# Altium schematic sheet IMU.SchDoc: =project_title
size Tabloid; CompanyName: Luxonis Holding; Organization: Luxonis Holding; Address1: 1925 Harmony Park Drive; Address2: Westminster, CO; Address3: 80234; Address4: United States; SheetNumber: 4; SheetTotal: 11
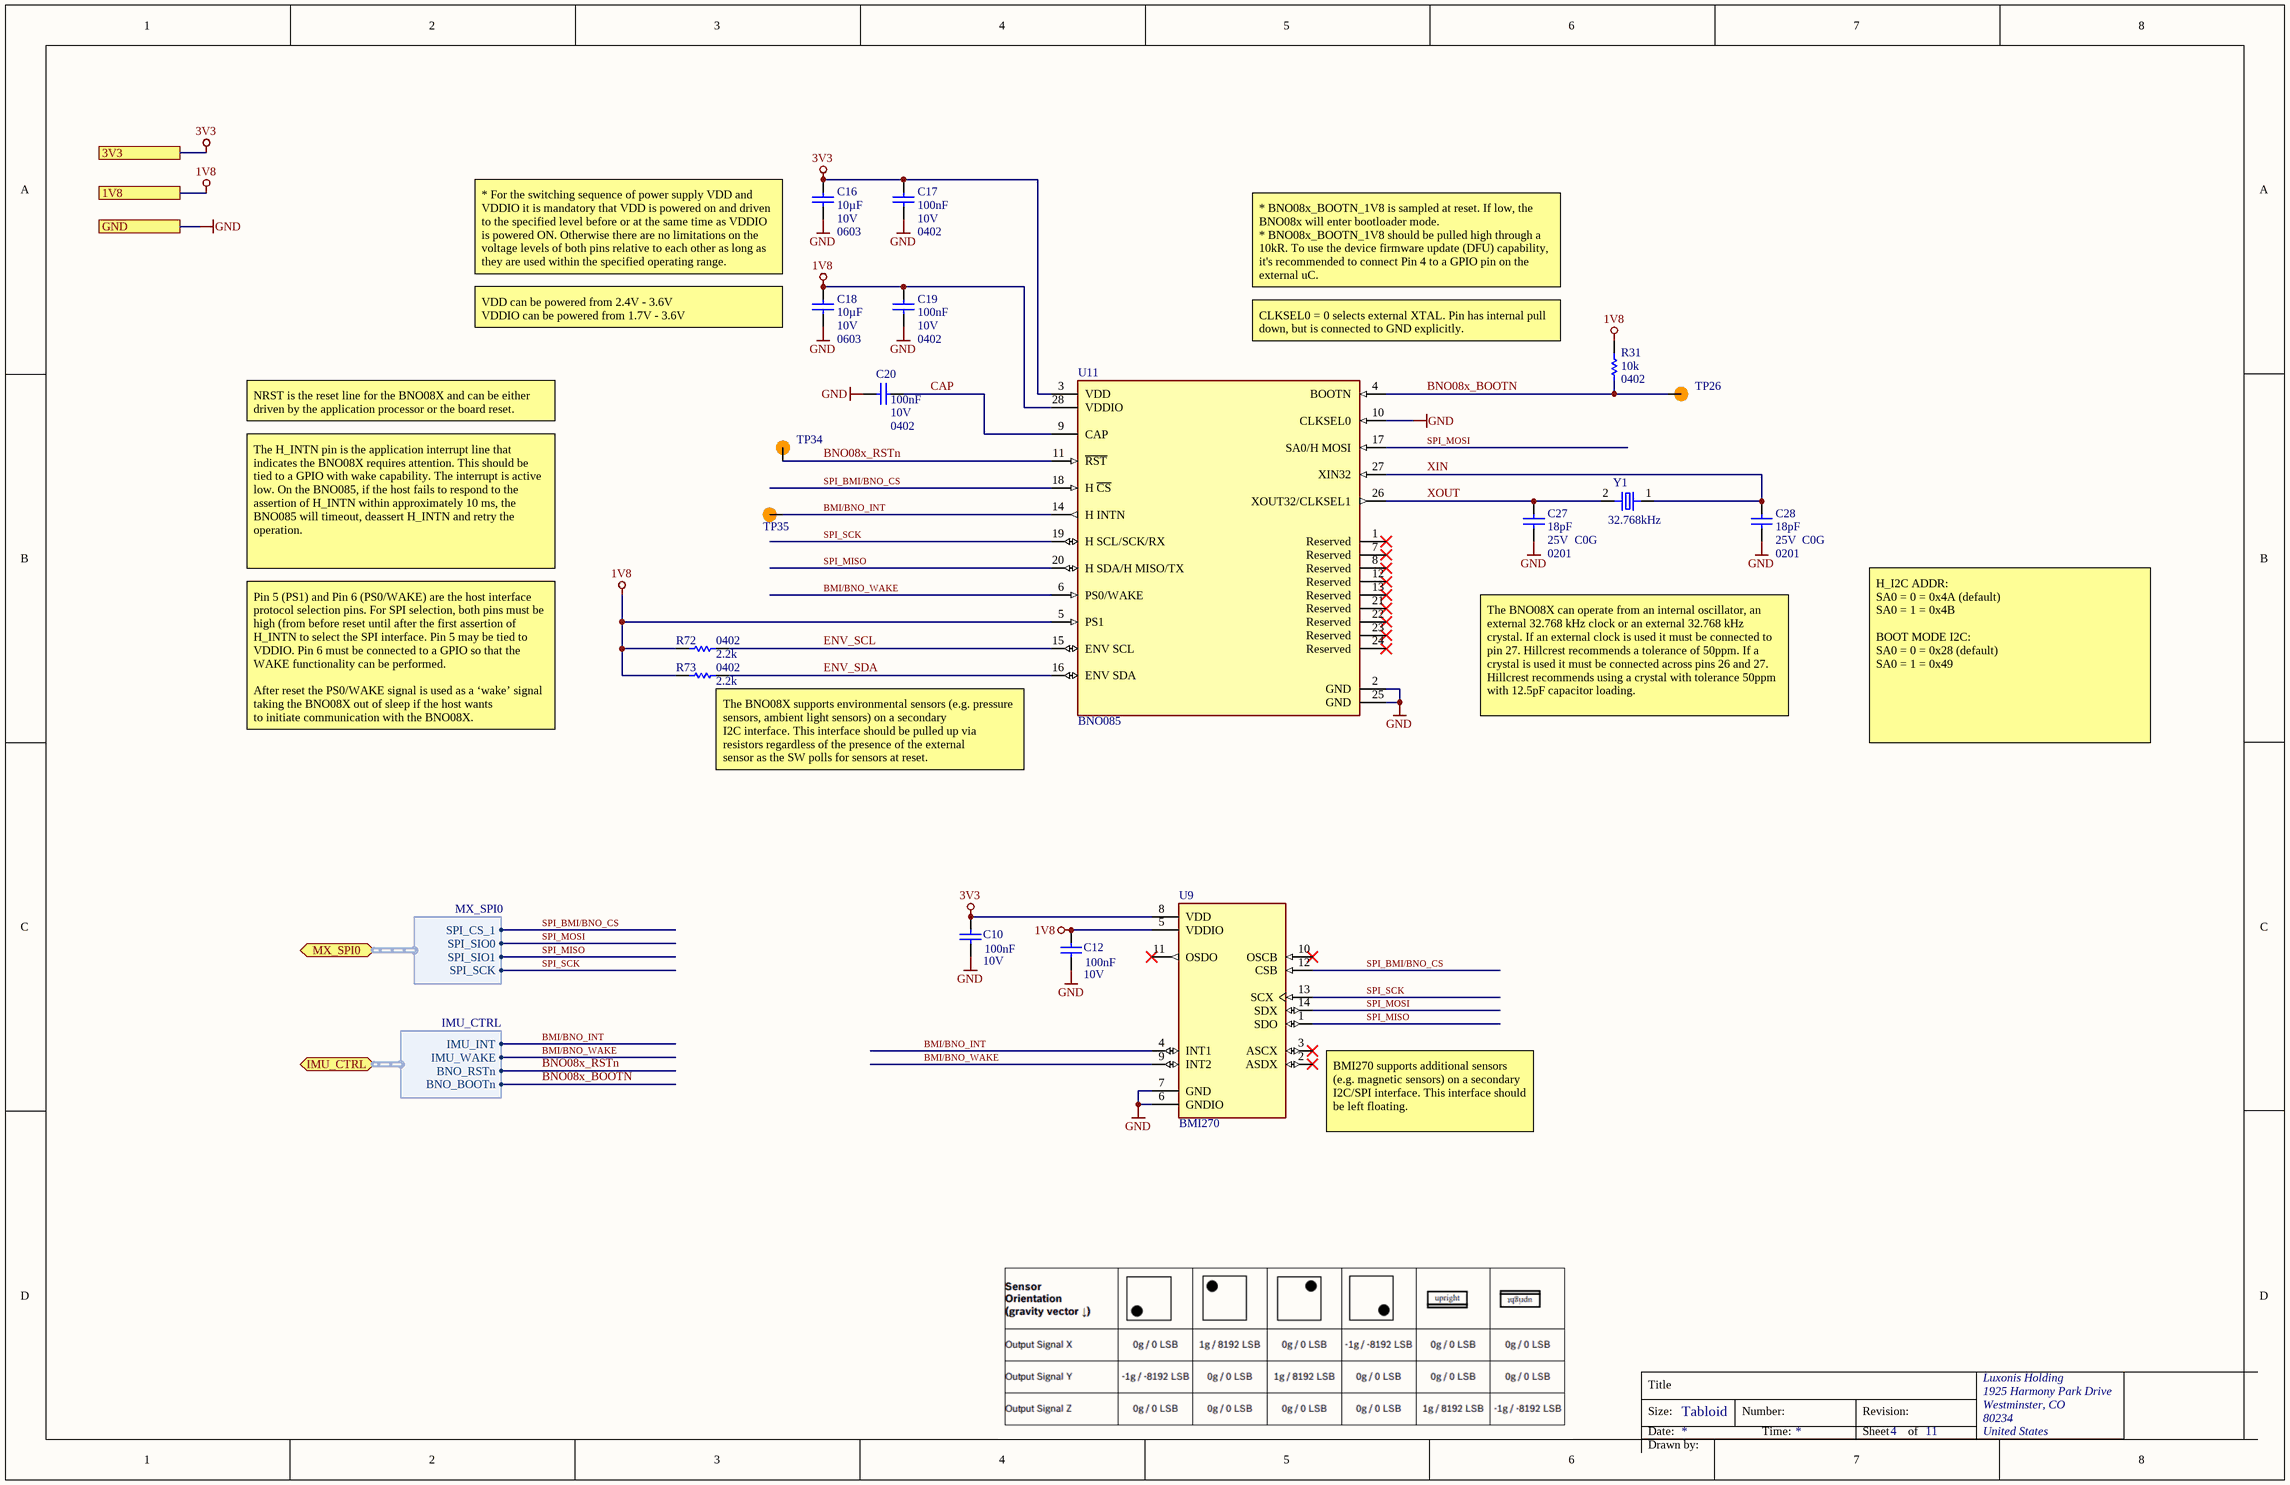
[diagram p0: IMU.SchDoc]

## Parts
C10  value 100nF  Voltage Rating: 10V  [CAPC0402(1005)70_L]  (hidden comment: GRM155R71A104JA01D)
C12  value 100nF  Voltage Rating: 10V  [CAPC0402(1005)70_L]  (hidden comment: GRM155R71A104JA01D)
C16  value 10µF  Case/Package: 0603  Voltage Rating: 10V  [CAPC0603(1608)100_L]  (hidden comment: GRM188R61A106ME69D)
C17  value 100nF  Case/Package: 0402  Voltage Rating: 10V  [CAPC0402(1005)70_N]  (hidden comment: GRM155R71A104JA01D)
C18  value 10µF  Case/Package: 0603  Voltage Rating: 10V  [CAPC0603(1608)100_L]  (hidden comment: GRM188R61A106ME69D)
C19  value 100nF  Case/Package: 0402  Voltage Rating: 10V  [CAPC0402(1005)70_N]  (hidden comment: GRM155R71A104JA01D)
C20  value 100nF  Case/Package: 0402  Voltage Rating: 10V  [CAPC0402(1005)70_N]  (hidden comment: GRM155R71A104JA01D)
C27  value 18pF  Case/Package: 0201  Voltage Rating: 25V  Dielectric: C0G  [CAPC0201(0603)33_L]  (hidden comment: GRM0335C1E180FA01D)
C28  value 18pF  Case/Package: 0201  Voltage Rating: 25V  Dielectric: C0G  [CAPC0201(0603)33_L]  (hidden comment: GRM0335C1E180FA01D)
R31  value 10k  Case/Package: 0402  [RESC0402(1005)_L]  (hidden comment: RC0402FR-1310KL)
R72  value 2.2k  Case/Package: 0402  [RESC0402(1005)_L]  (hidden comment: RC0402FR-072K2L)
R73  value 2.2k  Case/Package: 0402  [RESC0402(1005)_L]  (hidden comment: RC0402FR-072K2L)
TP26  TEST_POINT  [TP100_200_NS]  (value not drawn)  (no BOM)
TP34  TEST_POINT  [TP100_200_NS]  (value not drawn)  (no BOM)
TP35  TEST_POINT  [TP100_200_NS]  (value not drawn)  (no BOM)
U9  BMI270  [XDCR_BMI270]
U11  BNO085  [BNO085]
Y1  Frequency: 32.768kHz  [ABS06-127-32.768KHZ-T]  (hidden comment: ABS06-127-32.768KHZ-T)

## Ports
1V8, 3V3, GND, IMU_CTRL (bidir, harness IMU_CTRL), MX_SPI0 (bidir, harness MX_SPI0)

## Harnesses
MX_SPI0: SPI_SIO0, SPI_SIO1, SPI_CS_1, SPI_SCK
IMU_CTRL: IMU_INT, IMU_WAKE, BNO_RSTn, BNO_BOOTn

## Nets
1V8: C12.2 C18.2 C19.2 R31.2 R72.1 R73.1 U9.5(VDDIO) U11.5(PS1) U11.28(VDDIO) ; port 1V8
3V3: C10.2 C16.2 C17.2 U9.8(VDD) U11.3(VDD) ; port 3V3
GND: C10.1 C12.1 C16.1 C17.1 C18.1 C19.1 C20.2 C27.1 C28.1 U9.6(GNDIO) U9.7(GND) U11.2(GND) U11.10(CLKSEL0) U11.25(GND) ; port GND
BMI/BNO_INT: TP35.1 U9.4(INT1) U11.14(H_INTN) ; port IMU_CTRL.IMU_INT
BMI/BNO_WAKE: U9.9(INT2) U11.6(PS0/WAKE) ; port IMU_CTRL.IMU_WAKE
BNO08x_BOOTN: R31.1 TP26.1 U11.4(BOOTN) ; port IMU_CTRL.BNO_BOOTn
BNO08x_RSTn: TP34.1 U11.11(~{RST}) ; port IMU_CTRL.BNO_RSTn
CAP: C20.1 U11.9(CAP)
ENV_SCL: R72.2 U11.15(ENV_SCL)
ENV_SDA: R73.2 U11.16(ENV_SDA)
SPI_BMI/BNO_CS: U9.12(CSB) U11.18(H_~{CS}) ; port MX_SPI0.SPI_CS_1
SPI_MISO: U9.1(SDO) U11.20(H_SDA/H_MISO/TX) ; port MX_SPI0.SPI_SIO1
SPI_MOSI: U9.14(SDX) U11.17(SA0/H_MOSI) ; port MX_SPI0.SPI_SIO0
SPI_SCK: U9.13(SCX) U11.19(H_SCL/SCK/RX) ; port MX_SPI0.SPI_SCK
XIN: C28.2 U11.27(XIN32) Y1.1
XOUT: C27.2 U11.26(XOUT32/CLKSEL1) Y1.2

Not connected (* = marked no-connect by the designer): U9 2(ASDX)* 3(ASCX)* 10(OSCB)* 11(OSDO)*; U11 1(Reserved)* 7(Reserved)* 8(Reserved)* 12(Reserved)* 13(Reserved)* 21(Reserved)* 22(Reserved)* 23(Reserved)* 24(Reserved)*

## Notes on the sheet
- * For the switching sequence of power supply VDD and VDDIO it is mandatory that VDD is powered on and driven to the specified level before or at the same time as VDDIO is powered ON. Otherwise there are no limitations on the voltage levels of both pins relative to each other as long as they are used within the specified operating range.
- * BNO08x_BOOTN_1V8 is sampled at reset. If low, the BNO08x will enter bootloader mode.
  * BNO08x_BOOTN_1V8 should be pulled high through a 10kR. To use the device firmware update (DFU) capability, it's recommended to connect Pin 4 to a GPIO pin on the external uC.
- (near C18) VDD can be powered from 2.4V - 3.6V
  VDDIO can be powered from 1.7V - 3.6V
- CLKSEL0 = 0 selects external XTAL. Pin has internal pull down, but is connected to GND explicitly.
- NRST is the reset line for the BNO08X and can be either driven by the application processor or the board reset.
- The H_INTN pin is the application interrupt line that indicates the BNO08X requires attention. This should be tied to a GPIO with wake capability. The interrupt is active low. On the BNO085, if the host fails to respond to the assertion of H_INTN within approximately 10 ms, the BNO085 will timeout, deassert H_INTN and retry the operation.
- Pin 5 (PS1) and Pin 6 (PS0/WAKE) are the host interface protocol selection pins. For SPI selection, both pins must be high (from before reset until after the first assertion of H_INTN to select the SPI interface. Pin 5 may be tied to VDDIO. Pin 6 must be connected to a GPIO so that the WAKE functionality can be performed.
  After reset the PS0/WAKE signal is used as a ‘wake’ signal taking the BNO08X out of sleep if the host wants
  to initiate communication with the BNO08X.
- (near R73) The BNO08X supports environmental sensors (e.g. pressure sensors, ambient light sensors) on a secondary
  I2C interface. This interface should be pulled up via resistors regardless of the presence of the external
  sensor as the SW polls for sensors at reset.
- The BNO08X can operate from an internal oscillator, an external 32.768 kHz clock or an external 32.768 kHz crystal. If an external clock is used it must be connected to pin 27. Hillcrest recommends a tolerance of 50ppm. If a crystal is used it must be connected across pins 26 and 27. Hillcrest recommends using a crystal with tolerance 50ppm with 12.5pF capacitor loading.
- H_I2C ADDR:
  SA0 = 0 = 0x4A (default)
  SA0 = 1 = 0x4B
  BOOT MODE I2C:
  SA0 = 0 = 0x28 (default)
  SA0 = 1 = 0x49
- (near U9) BMI270 supports additional sensors (e.g. magnetic sensors) on a secondary I2C/SPI interface. This interface should be left floating.
- Title
- Size:
- Date:
- Tabloid
- Number:
- Time:
- Revision:
- Sheet
- of
- Drawn by:

## Library data of the parts
C10 C12 = CMP-108-000015-5: CAP CER 0.1UF 10V X7R 0402 5%; Manufacturer 1: Murata; Manufacturer Part Number 1: GRM155R71A104JA01D; Case/Package: 0402; Min Operating Temperature: -55°C; Max Operating Temperature: 125°C; Tolerance: 5%; Dielectric: X7R; Length: 1mm; Height: 0.5mm; Width: 0.02inch; Depth: 0.5mm; ComponentLink1URL: https://datasheet.ciiva.com/5411/product-5411135.pdf?src-supplier=Mouser; ComponentLink1Description: https://datasheet.ciiva.com/5411/product-5411135.pdf?src-supplier=Mouser; ComponentLink2URL: https://datasheet.ciiva.com/11618/c02e-11618821.pdf?src-supplier=Avnet; ComponentLink2Description: https://datasheet.ciiva.com/11618/c02e-11618821.pdf?src-supplier=Avnet; Design Item ID: GRM155R71A104JA01D; Mounting Technology: SMT
C16 C18 = CMP-004-000018-4: CAP CER 10UF 10V X5R 0603 20%; Manufacturer 1: Murata; Manufacturer Part Number 1: GRM188R61A106ME69D; Min Operating Temperature: -55°C; Max Operating Temperature: 85°C; Tolerance: 20%; Dielectric: X5R; Length: 1.6mm; Height: 0.8mm; Width: 0.8mm; Depth: 0.8mm; ComponentLink1URL: http://www.mouser.com/ds/2/281/c02e-2905.pdf?src-supplier=Mouser; ComponentLink1Description: http://www.mouser.com/ds/2/281/c02e-2905.pdf?src-supplier=Mouser; ComponentLink2URL: http://components.arrow.com/part/dataview/0323_06119472?src-supplier=Arrow+Europe; ComponentLink2Description: http://components.arrow.com/part/dataview/0323_06119472?src-supplier=Arrow+Europe; ComponentLink3URL: http://www.farnell.com/datasheets/2048014.pdf?src-supplier=Farnell; ComponentLink3Description: http://www.farnell.com/datasheets/2048014.pdf?src-supplier=Farnell; ComponentLink4URL: http://www.farnell.com/datasheets/1872210.pdf?src-supplier=Farnell; ComponentLink4Description: http://www.farnell.com/datasheets/1872210.pdf?src-supplier=Farnell; ComponentLink5URL: http://search.murata.co.jp/Ceramy/image/img/A01X/G101/ENG/GRM188R61A106ME69-01.pdf?src-supplier=Digi-Key; ComponentLink5Description: http://search.murata.co.jp/Ceramy/image/img/A01X/G101/ENG/GRM188R61A106ME69-01.pdf?src-supplier=Digi-Key; ComponentLink6URL: http://www.farnell.com/datasheets/1872210.pdf?src-supplier=Newark; ComponentLink6Description: http://www.farnell.com/datasheets/1872210.pdf?src-supplier=Newark; ComponentLink7URL: http://www.farnell.com/datasheets/2048014.pdf?src-supplier=Element14; ComponentLink7Description: http://www.farnell.com/datasheets/2048014.pdf?src-supplier=Element14; ComponentLink8URL: http://www.farnell.com/datasheets/2048014.pdf?src-supplier=Newark; ComponentLink8Description: http://www.farnell.com/datasheets/2048014.pdf?src-supplier=Newark; Design Item ID: GRM188R61A106ME69D; Mounting Technology: SMT
C17 C19 C20 = CMP-108-000015-4: CAP CER 0.1UF 10V X7R 0402 5%; Manufacturer 1: Murata; Manufacturer Part Number 1: GRM155R71A104JA01D; Min Operating Temperature: -55°C; Max Operating Temperature: 125°C; Tolerance: 5%; Dielectric: X7R; Length: 1mm; Height: 0.5mm; Width: 0.02inch; Depth: 0.5mm; ComponentLink1URL: https://datasheet.ciiva.com/5411/product-5411135.pdf?src-supplier=Mouser; ComponentLink1Description: https://datasheet.ciiva.com/5411/product-5411135.pdf?src-supplier=Mouser; ComponentLink2URL: https://datasheet.ciiva.com/11618/c02e-11618821.pdf?src-supplier=Avnet; ComponentLink2Description: https://datasheet.ciiva.com/11618/c02e-11618821.pdf?src-supplier=Avnet; Design Item ID: GRM155R71A104JA01D; Mounting Technology: SMT
C27 C28 = CMP-004-000003-6: CAP CER 18PF 25V C0G 0201 10%; Manufacturer 1: Murata; Tolerance: 1%; Manufacturer Part Number 1: GRM0335C1E180FA01D; Min Operating Temperature: -55°C; Max Operating Temperature: 125°C; Length: 0.024inch; Height: 0.3mm; Width: 0.3mm; ComponentLink1URL: https://datasheet.ciiva.com/29538/partnumbering-e-01-29538328.pdf?src-supplier=Digi-Key; ComponentLink1Description: https://datasheet.ciiva.com/29538/partnumbering-e-01-29538328.pdf?src-supplier=Digi-Key; Design Item ID: GRM0335C1E180FA01D; Mounting Technology: SMT
R31 = CMP-115-000004-7: RES SMD 10K OHM 1% 1/16W 0402; Manufacturer 1: Yageo; Temperature Coefficient: 100ppm/°C; Power Rating: 62.5mW; Voltage Rating: 50V; Manufacturer Part Number 1: RC0402FR-1310KL; Min Operating Temperature: -55°C; Max Operating Temperature: 155°C; Tolerance: 1%; Design Item ID: RC0402FR-1310KL
R72 R73 = CMP-013-000013-8: RES SMD 2.2K OHM 1% 1/16W 0402; Manufacturer 1: Yageo; Power Rating: 63mW; Voltage Rating: 50V; Manufacturer Part Number 1: RC0402FR-072K2L; Min Operating Temperature: -55°C; Max Operating Temperature: 155°C; Tolerance: 1%; Design Item ID: RC0402FR-072K2L
TP26 TP34 TP35 = CMP-015-000000-2: Manufacturer Part Number 1: /; Design Item ID: TEST_POINT; Source: LuxonisMaster.SchLib
U9 = CMP-061-000001-2: Accelerometer, Gyroscope, 6 Axis Sensor IÂ²C, SPI Output; Manufacturer 1: Bosch Sensortec; Manufacturer Part Number 1: BMI270
U11 = CMP-016-000000-2: IMU ACCEL/GYRO/MAG I2C 32BIT; Manufacturer 1: Hillcrest Laboratories; Sensor Type: Accelerometer,Gyroscope,Magnetometer; Manufacturer Part Number 1: BNO085; Case/Package: LGA
Y1 = CMP-006-000001-2: CRYSTAL 32.768kHz ±20ppm Crystal 12.5pF 90 kOhms 2-SMD, No Lead; Manufacturer 1: Abracon; Manufacturer Part Number 1: ABS06-127-32.768KHZ-T; Case/Package: SMD/SMT; Min Operating Temperature: -40°C; Max Operating Temperature: 85°C; Tolerance: 20ppm